# EAGLE design Adafruit bicolor bargraph 24 (EAGLE 6.3)
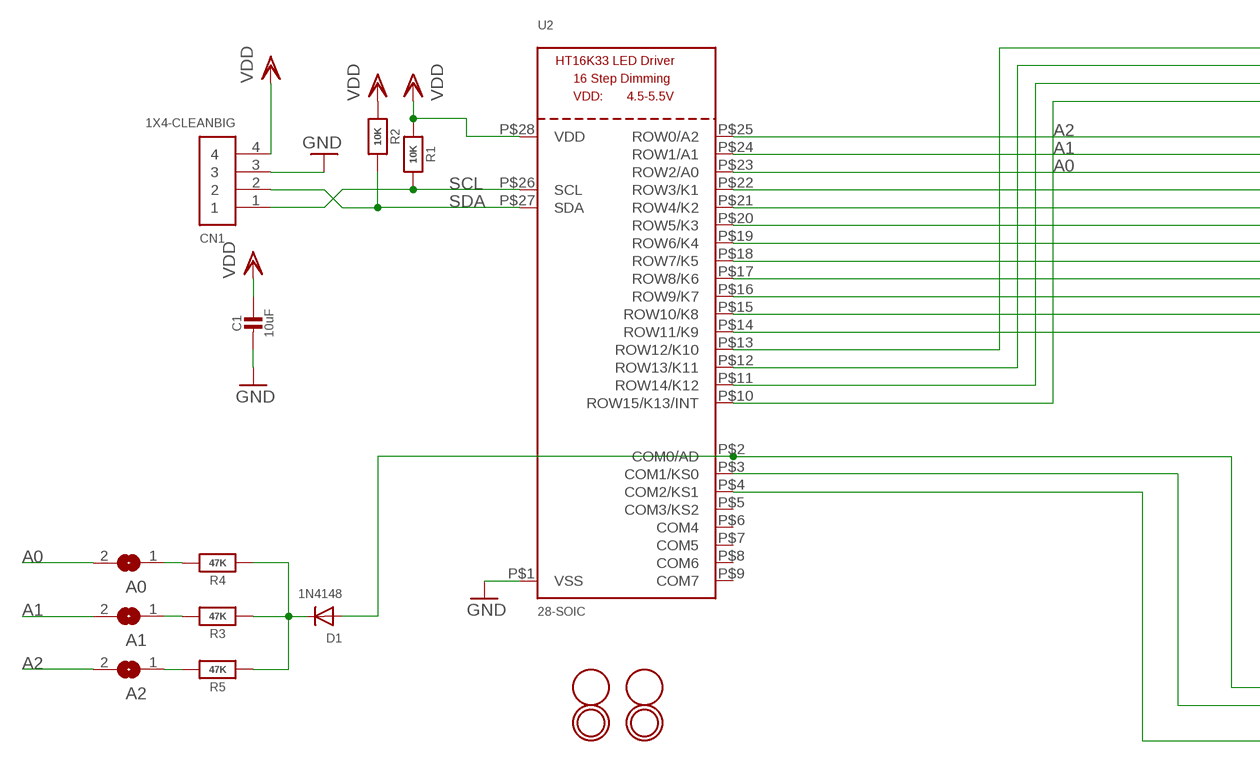
[diagram p0: schematic, sheet 1, part 1 of 2]
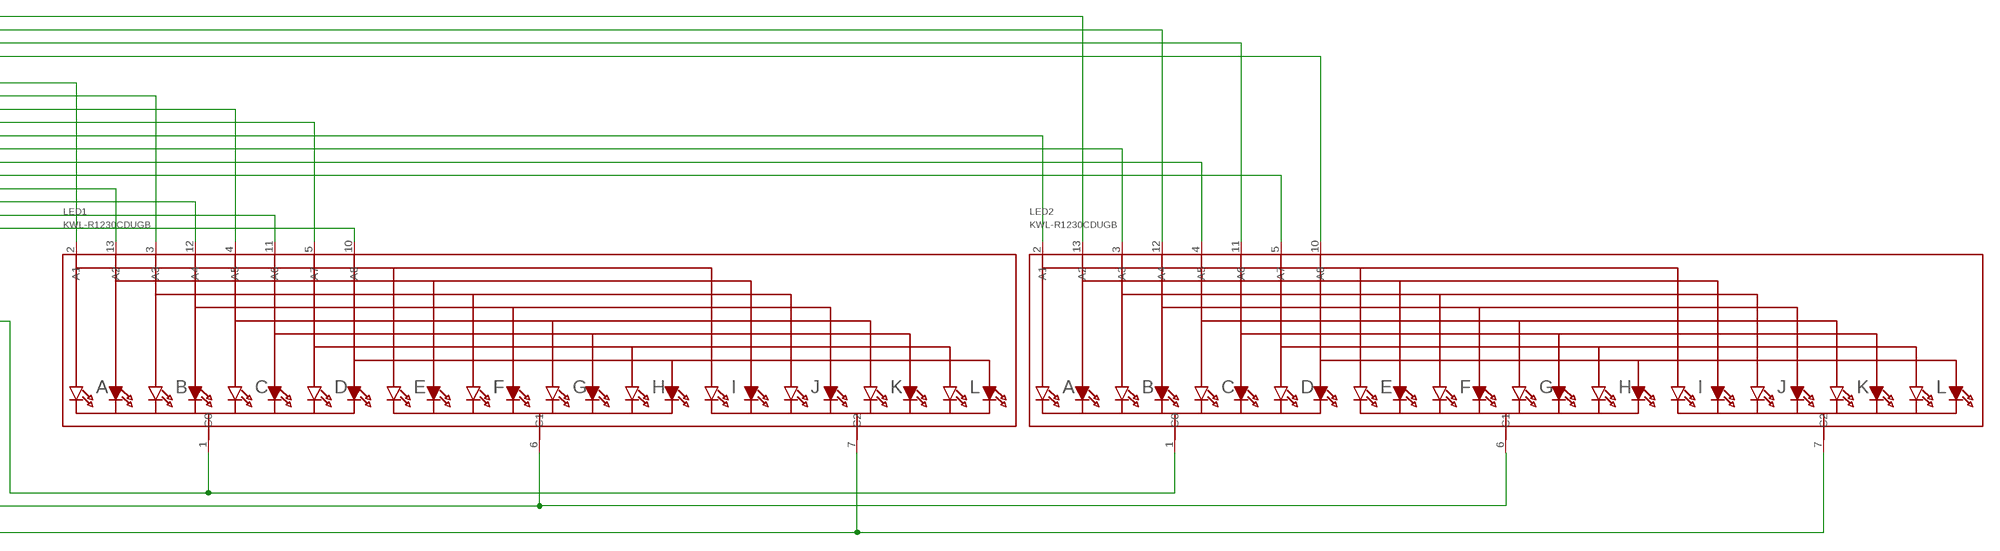
[diagram p1: schematic, sheet 1, part 2 of 2]

## Parts
A0  SOLDERJUMPERREFLOW_NOPASTE  [SOLDERJUMPER_REFLOW_NOPASTE]
A1  SOLDERJUMPERREFLOW_NOPASTE  [SOLDERJUMPER_REFLOW_NOPASTE]
A2  SOLDERJUMPERREFLOW_NOPASTE  [SOLDERJUMPER_REFLOW_NOPASTE]
C1  10uF  CAP_CERAMIC0805-NOOUTLINE  [0805-NO]
CN1  1X4-CLEANBIG  [1X04-CLEANBIG]
D1  1N4148  DIODESOD-323F  [SOD-323F]
LED1  KWL-R1230CDUGB  [SEGMENT_BICOL_BL-AR12Z3010]
LED2  KWL-R1230CDUGB  [SEGMENT_BICOL_BL-AR12Z3010]
R1  10K  RESISTOR0805_NOOUTLINE  [0805-NO]
R2  10K  RESISTOR0805_NOOUTLINE  [0805-NO]
R3  47K  RESISTOR0805_NOOUTLINE  [0805-NO]
R4  47K  RESISTOR0805_NOOUTLINE  [0805-NO]
R5  47K  RESISTOR0805_NOOUTLINE  [0805-NO]
U2  28-SOIC  HT16K33_SOP28  [SOP28_300MIL]
U$1  FIDUCIAL  [FIDUCIAL_1MM]
U$2  FIDUCIAL  [FIDUCIAL_1MM]
U$3  MOUNTINGHOLE2.5  [MOUNTINGHOLE_2.5_PLATED]
U$4  MOUNTINGHOLE2.5  [MOUNTINGHOLE_2.5_PLATED]

## Nets
A0: A0.2 LED1.4(A5) U2.P$23(ROW2/A0)
A1: A1.2 LED1.3(A3) U2.P$24(ROW1/A1)
A2: A2.2 LED1.2(A1) U2.P$25(ROW0/A2)
C0: D1.A LED1.1(C0) LED2.1(C0) U2.P$2(COM0/AD)
C1: LED1.6(C1) LED2.6(C1) U2.P$3(COM1/KS0)
C2: LED1.7(C2) LED2.7(C2) U2.P$4(COM2/KS1)
GND: C1.2 CN1.3 U2.P$1(VSS)
N$1: LED2.5(A7) U2.P$18(ROW7/K5)
N$2: LED1.13(A2) U2.P$17(ROW8/K6)
N$4: LED2.4(A5) U2.P$19(ROW6/K4)
N$9: A2.1 R5.2
N$16: D1.C R3.1 R4.1 R5.1
N$19: A1.1 R3.2
N$20: A0.1 R4.2
N$25: LED2.2(A1) U2.P$21(ROW4/K2)
N$26: LED1.5(A7) U2.P$22(ROW3/K1)
N$35: LED2.3(A3) U2.P$20(ROW5/K3)
N$39: LED1.12(A4) U2.P$16(ROW9/K7)
R10: LED1.11(A6) U2.P$15(ROW10/K8)
R11: LED1.10(A8) U2.P$14(ROW11/K9)
R12: LED2.13(A2) U2.P$13(ROW12/K10)
R13: LED2.12(A4) U2.P$12(ROW13/K11)
R14: LED2.11(A6) U2.P$11(ROW14/K12)
R15: LED2.10(A8) U2.P$10(ROW15/K13/INT)
SCL: CN1.1 R1.2 U2.P$26(SCL)
SDA: CN1.2 R2.2 U2.P$27(SDA)
VDD: C1.1 CN1.4 R1.1 R2.1 U2.P$28(VDD)
Unconnected: U2.P$5(COM3/KS2) U2.P$6(COM4) U2.P$7(COM5) U2.P$8(COM6) U2.P$9(COM7)

## Library data of the parts
A0 A1 A2 = microbuilder:SOLDERJUMPER: SMD Solder JUMPER Solder the two pads together to create a connection, or remove the solder to break it. REFLOW - Use this footprint for solder paste and reflow ovens. WAVE - Use this footprint for hand-soldering (larger pads). CLOSED - Has a trace between the two pads to ensure it is closed by default. The trace needs to be cut to disable the jumper, and can be closed again by creating a solder bridge between the two pads.
C1 = microbuilder:CAP_CERAMIC: Ceramic Capacitors For new designs, use the packages preceded by an '_' character since they are more reliable: The following footprints should be used on most boards: _0402 - Standard footprint for regular board layouts _0603 - Standard footprint for regular board layouts _0805 - Standard footprint for regular board layouts _1206 - Standard footprint for regular board layouts For extremely tight-pitch boards where space is at a premium, the following 'micro-pitch' footprints can be used (smaller pads, no silkscreen outline, etc.): _0402MP - Micro-pitch footprint for very dense/compact boards _0603MP - Micro-pitch footprint for very dense/compact boards _0805MP - Micro-pitch footprint for very dense/compact boards _1206MP - Micro-pitch footprint for very dense/compact boards
CN1 = adafruit:1X4: 4-pin connector
D1 = adafruit:DIODE: Diode SMADIODE - SMA Surface Mount Package 20V 1A Schottky Diode Digikey: 641-1014-6-ND DO-1N4148 - Through Hole Small Current Diode SOD-123 20V 1 A (.5mV Vf) Schottky Diode - Digikey: MBRX120TPMSCT-ND SOD-323 10V 570mA (.38mV Vf, 3ns) Schottky Diode - Digikey: ZLLS410CT-ND SOD-523 30V 30mA Schottky Diode (RB751S-40TE61) - Digikey: RB751S-40TE61CT-ND SOT23-R/W - SOT23 Package (R = Solder Paste/Reflow Ovens, W = Hand-Soldering) BAT54Film 40V 300mA - Digikey: 497-7162-1-ND
LED1 LED2 = microbuilder:KWL-R1230CDUGB
R1-R5 = microbuilder:RESISTOR: Resistors For new designs, use the packages preceded by an '_' character since they are more reliable: The following footprints should be used on most boards: _0402 - Standard footprint for regular board layouts _0603 - Standard footprint for regular board layouts _0805 - Standard footprint for regular board layouts _1206 - Standard footprint for regular board layouts For extremely tight-pitch boards where space is at a premium, the following 'micro-pitch' footprints can be used (smaller pads, no silkscreen outline, etc.): _0402MP - Micro-pitch footprint for very dense/compact boards _0603MP - Micro-pitch footprint for very dense/compact boards _0805MP - Micro-pitch footprint for very dense/compact boards _1206MP - Micro-pitch footprint for very dense/compact boards
U2 = microbuilder:HT16K33_SOP28
U$1 U$2 = adafruit:FIDUCIAL: For use by pick and place machines to calibrate the vision/machine, 1mm By microbuilder.eu
U$3 U$4 = microbuilder:MOUNTINGHOLE: Mounting Hole For #2 screws (0.086"/2.18mm width, 0.094"/2.4mm hole) use 2.5mm; BOM: EXCLUDE

## Board
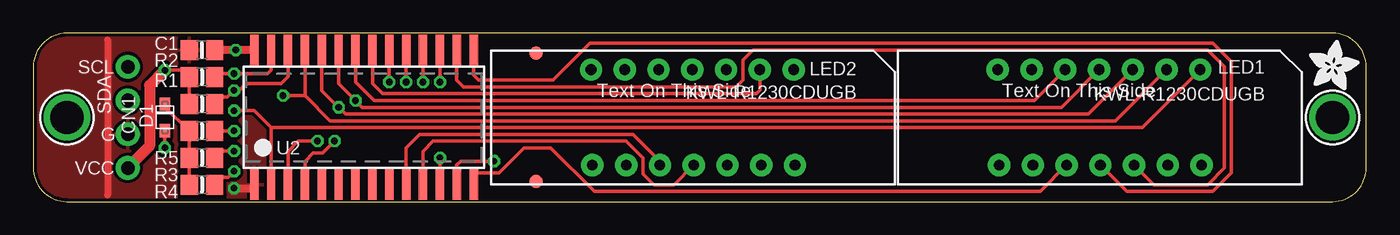
[diagram p2: board, top side]
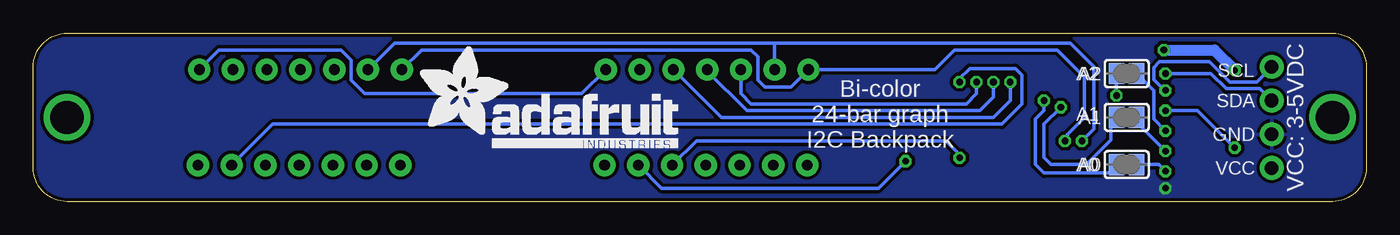
[diagram p3: board, bottom side, seen from below]

Size 100.33 x 12.7 mm. Coordinates in mm from the lower left corner, seen from the top.
Outline: 0,10.16 0,2.54 arc90 2.54,0 97.79,0 arc90 100.33,2.54 100.33,10.16 arc90 97.79,12.7 2.54,12.7 arc90 0,10.16
Copper layers (1*16): Top 0.035mm / dielectric 1.5mm / Bottom 0.035mm
Design rules "default *": minimum track width 10mil, minimum drill 19mil, track to track 10mil, track to pad 10mil, pad to pad 10mil, via to via 10mil, smd to smd 8mil, copper to edge 10mil, drill to drill 8mil, minimum pad ring 10mil, minimum via ring 8mil, stop-mask expansion 4mil, vias tented up to drill 20mil, thermal gap 10mil

### Footprints (pad centres in the part's own frame; a part is rotated, then mirrored left to right if it is on the bottom)
SOLDERJUMPER_REFLOW_NOPASTE = smd 1.168 x 1.6: 1 -0.762,0; 2 0.762,0
0805-NO = smd 1.3 x 1.5: 1 -0.95,0; 2 0.95,0
1X04-CLEANBIG = drill 1.016 pad 1.778: 1 -3.81,0; 2 -1.27,0; 3 1.27,0; 4 3.81,0
SOD-323F = smd 1 x 0.8: A -1,0; C 1,0
SEGMENT_BICOL_BL-AR12Z3010 = drill 0.8 pad 1.676: 1 -3.6,7.57; 2 -3.6,5.03; 3 -3.6,2.49; 4 -3.6,-0.05; 5 -3.6,-2.59; 6 -3.6,-5.13; 7 -3.6,-7.67; 8 3.6,-7.57; 9 3.6,-5.03; 10 3.6,-2.49; 11 3.6,0.05; 12 3.6,2.59; 13 3.6,5.13; 14 3.6,7.67
SOP28_300MIL = smd 0.635 x 2.286: P$1 -8.255,-5.08; P$2 -6.985,-5.08; P$3 -5.715,-5.08; P$4 -4.445,-5.08; P$5 -3.175,-5.08; P$6 -1.905,-5.08; P$7 -0.635,-5.08; P$8 0.635,-5.08; P$9 1.905,-5.08; P$10 3.175,-5.08; P$11 4.445,-5.08; P$12 5.715,-5.08; P$13 6.985,-5.08; P$14 8.255,-5.08; P$15 8.255,5.08; P$16 6.985,5.08; P$17 5.715,5.08; P$18 4.445,5.08; P$19 3.175,5.08; P$20 1.905,5.08; P$21 0.635,5.08; P$22 -0.635,5.08; P$23 -1.905,5.08; P$24 -3.175,5.08; P$25 -4.445,5.08; P$26 -5.715,5.08; P$27 -6.985,5.08; P$28 -8.255,5.08
FIDUCIAL_1MM = smd 1 x 1: 1 0,0
MOUNTINGHOLE_2.5_PLATED = drill 2.5 pad 3.2: P$1 0,0

### Placement (x,y rotation side)
A0  18.03,2.79 180 bottom
A1  18.03,6.35 180 bottom
A2  18.03,9.65 180 bottom
C1  12.7,11.43 180 top
CN1  7.11,6.35 270 top
D1  9.91,6.35 90 top
LED1  80.26,6.35 270 top
LED2  49.66,6.35 270 top
R1  12.7,7.37 0 top
R2  12.7,9.4 0 top
R3  12.7,3.3 0 top
R4  12.7,1.27 0 top
R5  12.7,5.33 0 top
U2  24.89,6.35 0 top
U$1  37.85,1.52 270 top
U$2  37.85,11.18 270 top
U$3  97.79,6.35 0 top
U$4  2.54,6.35 0 top
U$5  [ADAFRUIT_TEXT_20MM]  71.37,4.06 0 bottom
U$6  [ADAFRUIT_3.5MM]  96.01,8.38 0 top

### Tracks (layer width: path | path; a pad name or v marks a point on that pad's centre or on a via)
A0  (via drill 0.5)
  Top 0.254: LED1.4 77.38,7.11 24.77,7.11 v24.26,7.62 22.99,8.89 U2.P$23
  Bottom 0.254: A0.2 18.8,2.16 24.26,2.16 24.89,2.79 24.89,6.22 24.26,6.86 v24.26,7.62
A1  (via drill 0.5)
  Top 0.254: LED1.3 79.41,6.6 23.5,6.6 v22.99,7.11 21.72,8.38 U2.P$24
  Bottom 0.254: v22.99,7.11 24.26,5.84 24.26,3.32 23.73,2.79 21.08,2.79 19.24,4.64 19.24,6.35 A1.2
A2  (via drill 0.5)
  Top 0.254: U2.P$25 20.45,8 | 20.45,8 22.35,6.1 81.44,6.1 LED1.2 | v18.8,8 20.45,8
  Bottom 0.254: A2.2 v18.8,8
C0  (via drill 0.5)
  Top 0.254: LED1.1 83.47,5.59 17.91,5.59 | 17.91,5.59 U2.P$2 | 17.91,5.59 16.64,6.86 v15.11,6.86 | D1.A v9.91,4.06
  Bottom 0.254: LED2.1 59.05,8.13 75.37,8.13 76.39,9.15 76.39,10.66 77.16,11.43 86.35,11.43 LED1.1 | v15.11,6.86 12.7,6.86 v9.91,4.06
C1  (via drill 0.5)
  Top 0.254: U2.P$3 19.18,3.8 19.95,4.57 v21.4,4.57
  Bottom 0.254: 44.53,11.94 22.29,11.94 20.51,10.16 20.51,5.46 v21.4,4.57 | LED2.6 44.53,11.94 | 44.53,11.94 73.15,11.94 LED1.6
C2  (via drill 0.5)
  Top 0.254: U2.P$4 20.45,3.05 21.08,3.68 21.78,3.68 v22.67,4.57
  Bottom 0.254: LED1.7 71.11,11.43 46.3,11.43 45.78,10.92 45.78,9.15 45.27,8.64 43.3,8.64 LED2.7 32.47,9.95 30.99,11.43 23.24,11.43 21.21,9.4 21.21,6.35 22.48,5.08 22.48,4.76 v22.67,4.57
GND  (via drill 0.5)
  Top 0.508: 5.59,12.19 5.59,0.51
  Top 0.61: v15.11,1.02 16.64,1.02 U2.P$1
  pour Bottom: 0,0 102.11,0 102.11,12.7 0,12.7
  pour Top: 0,0 102.11,0 102.11,12.7 0,12.7
N$1  (via drill 0.5)
  Top 0.254: U2.P$18 v29.34,9.02
  Bottom 0.254: v29.34,9.02 29.34,8.14 30.11,7.37 46.3,7.37 47.07,8.13 LED2.5
N$2  (via drill 0.5)
  Top 0.254: U2.P$17 v30.61,9.02
  Bottom 0.254: v30.61,9.02 30.61,9.26 29.83,10.03 26.42,10.03 25.91,9.53 25.91,7.37 27.43,5.84 82.3,5.84 LED1.13
N$4  (via drill 0.5)
  Top 0.254: U2.P$19 v28.07,9.02
  Bottom 0.254: v28.07,9.02 28.07,7.88 29.09,6.86 46.61,6.86 49.61,9.86 LED2.4
N$9  (via drill 0.5)
  Top 0.254: v15.11,5.33 R5.2
  Bottom 0.254: A2.1 16,8.38 16,6.22 v15.11,5.33
N$16
  Top 0.254: R4.1 R3.1 R5.1 9.91,7.13 D1.C
N$19  (via drill 0.5)
  Top 0.254: v15.11,3.81 13.7,3.81 R3.2
  Bottom 0.254: A1.1 17.27,5.97 v15.11,3.81
N$20  (via drill 0.5)
  Top 0.254: v15.11,2.29 14.67,1.84 13.7,1.84 R4.2
  Bottom 0.254: A0.1 15.62,2.79 v15.11,2.29
N$25
  Top 0.254: U2.P$21 25.53,8.9 26.3,8.13 54.42,8.13 54.69,8.39 LED2.2
N$26
  Top 0.254: U2.P$22 24.26,9.02 25.65,7.62 75.34,7.62 LED1.5
N$35  (via drill 0.5)
  Top 0.254: U2.P$20 v26.8,9.02
  Bottom 0.254: v26.8,9.02 26.8,7.63 28.07,6.35 48.55,6.35 LED2.3
N$39
  Top 0.254: U2.P$16 31.88,9.16 32.4,8.64 52.89,8.64 53.4,9.15 53.4,10.66 54.17,11.43 88.39,11.43 89.66,10.16 89.66,2.54 88.39,1.27 84.33,1.27 LED1.12
R10
  Top 0.254: LED1.11 82.3,0.76 88.77,0.76 90.17,2.16 90.17,10.54 88.77,11.94 41.91,11.94 39.12,9.14 33.53,9.14 33.15,9.53 U2.P$15
R11
  Top 0.254: LED1.10 75.79,0.76 42.25,0.76 38.94,4.06 36.96,4.06 35.05,2.16 33.15,2.16 U2.P$14
R12  (via drill 0.5)
  Top 0.254: U2.P$13 31.88,2.76 32.16,3.05 v34.67,3.05
  Bottom 0.254: LED2.13 53.05,1.02 36.7,1.02 v34.67,3.05
R13  (via drill 0.5)
  Top 0.254: v30.61,3.3 U2.P$12
  Bottom 0.254: LED2.12 50.42,4.57 31.63,4.57 30.61,3.54 v30.61,3.3
R14
  Top 0.254: U2.P$11 29.34,3.8 30.11,4.57 44.62,4.57 45.91,3.28 45.91,2.1 46.74,1.27 48.23,1.27 LED2.11
R15
  Top 0.254: LED2.10 47.17,3.05 45.13,5.08 29.09,5.08 28.07,4.06 U2.P$10
SCL  (via drill 0.5)
  Top 0.254: U2.P$26 19.18,9.41 18.65,8.89 16,8.89 15.49,8.38 v15.11,8.38 14.61,7.87 13.7,7.87 R1.2 13.72,7.37
  Bottom 0.254: v15.11,8.38 15.18,8.38 16,9.21 16,10.1 15.56,10.54 11.81,10.54 10.29,9.02 8.26,9.02 CN1.1
SDA  (via drill 0.5)
  Top 0.254: U2.P$27 17.91,9.91 17.65,9.65 v15.11,9.65 13.7,9.65 R2.2
  Bottom 0.254: CN1.2 8,8.51 10.54,8.51 11.68,9.65 v15.11,9.65
VDD  (via drill 0.5)
  Top 0.254: R1.1 R2.1 11.7,9.91 v9.91,9.91
  Top 0.61: U2.P$28 v15.24,11.43 C1.1
  Top 0.813: v9.91,9.91 8.76,8.76 8.76,4.19 CN1.4
  Bottom 0.813: v15.24,11.43 11.43,11.43 v9.91,9.91

### Text on the board
tPlace: SCL | Text On This Side | Text On This Side | SDA | G | VCC
bPlace: SCL | A2 | SDA | Bi-color / 24-bar graph / I2C Backpack | VCC: 3-5VDC | GND | A1 | VCC | A0
tDocu: A0 | A1 | A2 | VCC | GND | SDA | SCL
bDocu: + | - | D | C